# Altium schematic sheet Measurements.SchDoc
size A4; SheetNumber: 14; SheetTotal: 15
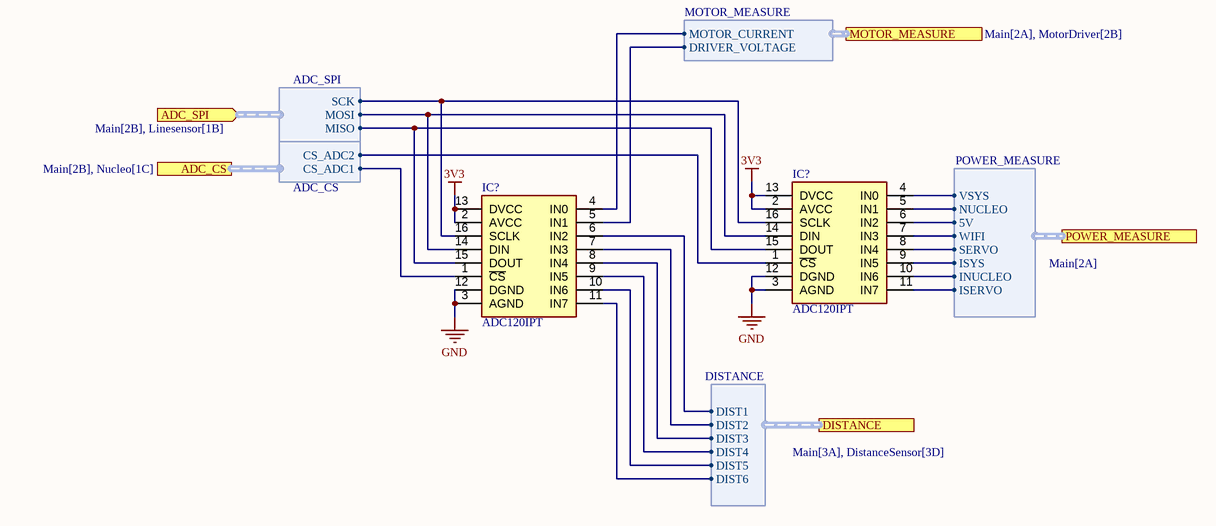
[diagram p0: Measurements.SchDoc]

## Parts
(Parts that share a designator on the sheet are numbered #1, #2 ... from top to bottom, then left to right.)
IC?#1  ADC120IPT  [TSSOP-16]
IC?#2  ADC120IPT  [TSSOP-16]

## Ports
ADC_CS (harness ADC_CS, see Main[2B], Nucleo[1C]), ADC_SPI (in, harness ADC_SPI, see Main[2B], Linesensor[1B]), DISTANCE (harness DISTANCE, see Main[3A], DistanceSensor[3D]), MOTOR_MEASURE (harness MOTOR_MEASURE, see Main[2A], MotorDriver[2B]), POWER_MEASURE (harness POWER_MEASURE, see Main[2A])

## Harnesses
DISTANCE: DIST1, DIST2, DIST3, DIST4, DIST5, DIST6
MOTOR_MEASURE: MOTOR_CURRENT, DRIVER_VOLTAGE
ADC_SPI: MOSI, MISO, SCK
ADC_CS: CS_ADC2, CS_ADC1
POWER_MEASURE: VSYS, NUCLEO, 5V, WIFI, SERVO, ISYS, INUCLEO, ISERVO

## Nets
3V3: IC?#1.2(AVCC) IC?#1.13(DVCC) IC?#2.2(AVCC) IC?#2.13(DVCC)
GND: IC?#1.3(AGND) IC?#1.12(DGND) IC?#2.3(AGND) IC?#2.12(DGND)
NetIC?#1_1: IC?#1.1(~{CS}) ; port ADC_CS.CS_ADC2
NetIC?#1_4: IC?#1.4(IN0) ; port POWER_MEASURE.VSYS
NetIC?#1_5: IC?#1.5(IN1) ; port POWER_MEASURE.NUCLEO
NetIC?#1_6: IC?#1.6(IN2) ; port POWER_MEASURE.5V
NetIC?#1_7: IC?#1.7(IN3) ; port POWER_MEASURE.WIFI
NetIC?#1_8: IC?#1.8(IN4) ; port POWER_MEASURE.SERVO
NetIC?#1_9: IC?#1.9(IN5) ; port POWER_MEASURE.ISYS
NetIC?#1_10: IC?#1.10(IN6) ; port POWER_MEASURE.INUCLEO
NetIC?#1_11: IC?#1.11(IN7) ; port POWER_MEASURE.ISERVO
NetIC?#1_14: IC?#1.14(DIN) IC?#2.14(DIN) ; port ADC_SPI.MOSI
NetIC?#1_15: IC?#1.15(DOUT) IC?#2.15(DOUT) ; port ADC_SPI.MISO
NetIC?#1_16: IC?#1.16(SCLK) IC?#2.16(SCLK) ; port ADC_SPI.SCK
NetIC?#2_1: IC?#2.1(~{CS}) ; port ADC_CS.CS_ADC1
NetIC?#2_4: IC?#2.4(IN0) ; port MOTOR_MEASURE.MOTOR_CURRENT
NetIC?#2_5: IC?#2.5(IN1) ; port MOTOR_MEASURE.DRIVER_VOLTAGE
NetIC?#2_6: IC?#2.6(IN2) ; port DISTANCE.DIST1
NetIC?#2_7: IC?#2.7(IN3) ; port DISTANCE.DIST2
NetIC?#2_8: IC?#2.8(IN4) ; port DISTANCE.DIST3
NetIC?#2_9: IC?#2.9(IN5) ; port DISTANCE.DIST4
NetIC?#2_10: IC?#2.10(IN6) ; port DISTANCE.DIST5
NetIC?#2_11: IC?#2.11(IN7) ; port DISTANCE.DIST6

## Notes on the sheet
- Size
- Date
- A4
- Title
- Sheet number
- Author
- Revision

## Library data of the parts
IC?#1 IC?#2 = ADC120IPT: Integrated Circuit; Manufacturer_Name: STMicroelectronics; Datasheet Link: https://www.st.com/resource/en/datasheet/adc120.pdf; Height: 1.2mm; Manufacturer_Part_Number: ADC120IPT; Mouser Part Number: 511-ADC120IPT; Mouser Price/Stock: https://www.mouser.co.uk/ProductDetail/STMicroelectronics/ADC120IPT?qs=PzGy0jfpSMuHQWzRzzPRMw%3D%3D; Arrow Part Number: ADC120IPT; Arrow Price/Stock: https://www.arrow.com/en/products/adc120ipt/stmicroelectronics?region=nac